# EAGLE schematic Rainbow Badge WIP1 (EAGLE 7.2.0)
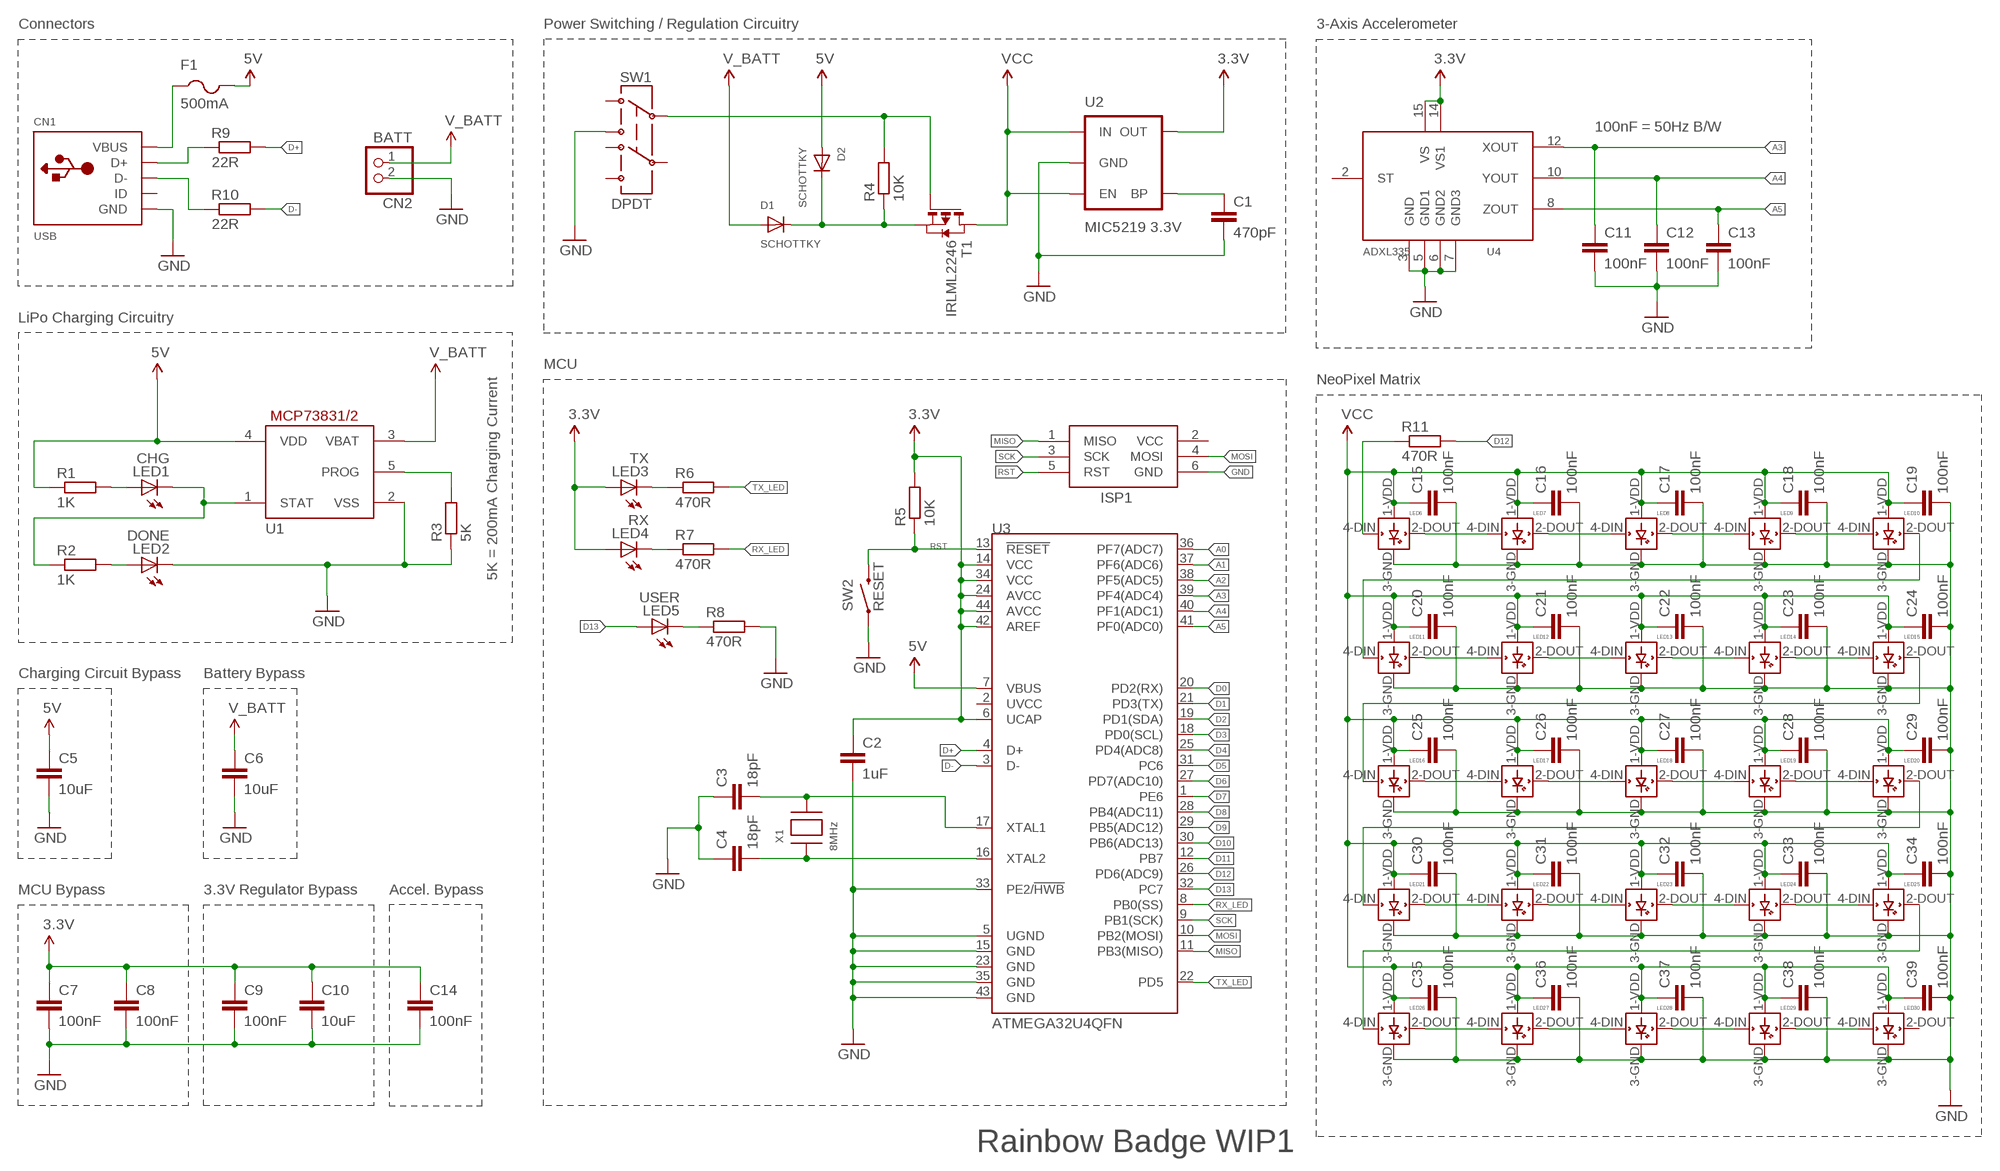
[diagram p0: schematic, sheet 1]

## Parts
C1  470pF  C-EUC0603  [C0603]
C2  1uF  C-EUC0603  [C0603]
C3  18pF  C-EUC0603  [C0603]
C4  18pF  C-EUC0603  [C0603]
C5  10uF  C-EUC1206  [C1206]
C6  10uF  C-EUC1206  [C1206]
C7  100nF  C-EUC0603  [C0603]
C8  100nF  C-EUC0603  [C0603]
C9  100nF  C-EUC0603  [C0603]
C10  10uF  C-EUC1206  [C1206]
C11  100nF  C-EUC0603  [C0603]
C12  100nF  C-EUC0603  [C0603]
C13  100nF  C-EUC0603  [C0603]
C14  100nF  C-EUC0603  [C0603]
C15  100nF  C-EUC0805  [C0805]
C16  100nF  C-EUC0805  [C0805]
C17  100nF  C-EUC0805  [C0805]
C18  100nF  C-EUC0805  [C0805]
C19  100nF  C-EUC0805  [C0805]
C20  100nF  C-EUC0805  [C0805]
C21  100nF  C-EUC0805  [C0805]
C22  100nF  C-EUC0805  [C0805]
C23  100nF  C-EUC0805  [C0805]
C24  100nF  C-EUC0805  [C0805]
C25  100nF  C-EUC0805  [C0805]
C26  100nF  C-EUC0805  [C0805]
C27  100nF  C-EUC0805  [C0805]
C28  100nF  C-EUC0805  [C0805]
C29  100nF  C-EUC0805  [C0805]
C30  100nF  C-EUC0805  [C0805]
C31  100nF  C-EUC0805  [C0805]
C32  100nF  C-EUC0805  [C0805]
C33  100nF  C-EUC0805  [C0805]
C34  100nF  C-EUC0805  [C0805]
C35  100nF  C-EUC0805  [C0805]
C36  100nF  C-EUC0805  [C0805]
C37  100nF  C-EUC0805  [C0805]
C38  100nF  C-EUC0805  [C0805]
C39  100nF  C-EUC0805  [C0805]
CN1  USB  USBMINIB  [USB-MINIB]
CN2  BATT  JST_2PIN-SMT-RA  [JST-PH-2-SMT-RA]
D1  SCHOTTKY  DIODESOD-123  [SOD-123]
D2  SCHOTTKY  DIODESOD-123  [SOD-123]
F1  500mA  PTCFUSE-1206  [R1206]
ISP1  AVRISP  AVRISP-6  [AVRISP]
LED1  CHG  LEDCHIP-LED0603  [CHIP-LED0603]
LED2  DONE  LEDCHIP-LED0603  [CHIP-LED0603]
LED3  TX  LEDCHIP-LED0603  [CHIP-LED0603]
LED4  RX  LEDCHIP-LED0603  [CHIP-LED0603]
LED5  USER  LEDCHIP-LED0603  [CHIP-LED0603]
LED6  WS2812B  [WS2812B]
LED7  WS2812B  [WS2812B]
LED8  WS2812B  [WS2812B]
LED9  WS2812B  [WS2812B]
LED10  WS2812B  [WS2812B]
LED11  WS2812B  [WS2812B]
LED12  WS2812B  [WS2812B]
LED13  WS2812B  [WS2812B]
LED14  WS2812B  [WS2812B]
LED15  WS2812B  [WS2812B]
LED16  WS2812B  [WS2812B]
LED17  WS2812B  [WS2812B]
LED18  WS2812B  [WS2812B]
LED19  WS2812B  [WS2812B]
LED20  WS2812B  [WS2812B]
LED21  WS2812B  [WS2812B]
LED22  WS2812B  [WS2812B]
LED23  WS2812B  [WS2812B]
LED24  WS2812B  [WS2812B]
LED25  WS2812B  [WS2812B]
LED26  WS2812B  [WS2812B]
LED27  WS2812B  [WS2812B]
LED28  WS2812B  [WS2812B]
LED29  WS2812B  [WS2812B]
LED30  WS2812B  [WS2812B]
R1  1K  R-EU_R0603  [R0603]
R2  1K  R-EU_R0603  [R0603]
R3  5K  R-EU_R0603  [R0603]
R4  10K  R-EU_R0603  [R0603]
R5  10K  R-EU_R0603  [R0603]
R6  470R  R-EU_R0603  [R0603]
R7  470R  R-EU_R0603  [R0603]
R8  470R  R-EU_R0603  [R0603]
R9  22R  R-EU_R0603  [R0603]
R10  22R  R-EU_R0603  [R0603]
R11  470R  R-EU_R0603  [R0603]
SW1  DPDT  SWITCH-DPDTAYZ0202  [AYZ0202]
SW2  RESET  SWITCH-MOMENTARY-2SMD  [TACTILE-SWITCH-SMD]
T1  IRLML2246  PMOSSOT23  [SOT-23]
U1  MCP73831/OT  [SOT23-5L]
U2  MIC5219 3.3V  V_REG_MIC52193.3V  [SOT23-5]
U3  ATMEGA32U4QFN  [QFN-44]
U4  ADXL335  ADXL33X  [16LCSP]
X1  8MHz  XTALNX5032  [NX5032]

## Nets
3.3V: C2.1 C7.1 C8.1 C9.1 C10.1 C14.1 LED3.A LED4.A R5.2 U2.5(OUT) U3.6(UCAP) U3.14(VCC) U3.24(AVCC) U3.34(VCC) U3.42(AREF) U3.44(AVCC) U4.14(VS1) U4.15(VS)
5V: C5.1 D2.A F1.2 R1.1 U1.4(VDD) U3.7(VBUS)
A0: U3.36(PF7(ADC7))
A1: U3.37(PF6(ADC6))
A2: U3.38(PF5(ADC5))
A3: C11.1 U3.39(PF4(ADC4)) U4.12(XOUT)
A4: C12.1 U3.40(PF1(ADC1)) U4.10(YOUT)
A5: C13.1 U3.41(PF0(ADC0)) U4.8(ZOUT)
D0: U3.20(PD2(RX))
D1: U3.21(PD3(TX))
D2: U3.19(PD1(SDA))
D3: U3.18(PD0(SCL))
D4: U3.25(PD4(ADC8))
D5: U3.31(PC6)
D6: U3.27(PD7(ADC10))
D7: U3.1(PE6)
D8: U3.28(PB4(ADC11))
D9: U3.29(PB5(ADC12))
D10: U3.30(PB6(ADC13))
D11: U3.12(PB7)
D12: R11.2 U3.26(PD6(ADC9))
D13: LED5.A U3.32(PC7)
D+: R9.2 U3.4(D+)
D-: R10.2 U3.3(D-)
GND: C1.2 C2.2 C3.1 C4.1 C5.2 C6.2 C7.2 C8.2 C9.2 C10.2 C11.2 C12.2 C13.2 C14.2 C15.2 C16.2 C17.2 C18.2 C19.2 C20.2 C21.2 C22.2 C23.2 C24.2 C25.2 C26.2 C27.2 C28.2 C29.2 C30.2 C31.2 C32.2 C33.2 C34.2 C35.2 C36.2 C37.2 C38.2 C39.2 CN1.GND CN2.2 ISP1.6(GND) LED2.C LED6.3-GND(GND) LED7.3-GND(GND) LED8.3-GND(GND) LED9.3-GND(GND) LED10.3-GND(GND) LED11.3-GND(GND) LED12.3-GND(GND) LED13.3-GND(GND) LED14.3-GND(GND) LED15.3-GND(GND) LED16.3-GND(GND) LED17.3-GND(GND) LED18.3-GND(GND) LED19.3-GND(GND) LED20.3-GND(GND) LED21.3-GND(GND) LED22.3-GND(GND) LED23.3-GND(GND) LED24.3-GND(GND) LED25.3-GND(GND) LED26.3-GND(GND) LED27.3-GND(GND) LED28.3-GND(GND) LED29.3-GND(GND) LED30.3-GND(GND) R3.1 R8.2 SW1.3 SW2.1 U1.2(VSS) U2.2(GND) U3.5(UGND) U3.15(GND) U3.23(GND) U3.33(PE2/!HWB) U3.35(GND) U3.43(GND) U4.3(GND) U4.5(GND1) U4.6(GND2) U4.7(GND3)
MISO: ISP1.1(MISO) U3.11(PB3(MISO))
MOSI: ISP1.4(MOSI) U3.10(PB2(MOSI))
N$1: LED1.C R2.1 U1.1(STAT)
N$2: LED2.A R2.2
N$3: LED1.A R1.2
N$4: R3.2 U1.5(PROG)
N$5: CN1.VBUS F1.1
N$6: LED3.C R6.1
N$7: C1.1 U2.4(BP)
N$8: R4.2 SW1.2 T1.3(G)
N$9: D1.C D2.C R4.1 T1.2(S)
N$10: C3.2 U3.17(XTAL1) X1.P$2
N$11: C4.2 U3.16(XTAL2) X1.P$1
N$12: LED4.C R7.1
N$13: LED5.C R8.1
N$14: CN1.D+ R9.1
N$15: CN1.D- R10.1
N$16: LED6.4-DIN(DIN) R11.1
N$66: LED6.2-DOUT(DOUT) LED7.4-DIN(DIN)
N$67: LED7.2-DOUT(DOUT) LED8.4-DIN(DIN)
N$68: LED8.2-DOUT(DOUT) LED9.4-DIN(DIN)
N$69: LED9.2-DOUT(DOUT) LED10.4-DIN(DIN)
N$70: LED11.2-DOUT(DOUT) LED12.4-DIN(DIN)
N$71: LED12.2-DOUT(DOUT) LED13.4-DIN(DIN)
N$72: LED13.2-DOUT(DOUT) LED14.4-DIN(DIN)
N$73: LED14.2-DOUT(DOUT) LED15.4-DIN(DIN)
N$74: LED16.2-DOUT(DOUT) LED17.4-DIN(DIN)
N$75: LED17.2-DOUT(DOUT) LED18.4-DIN(DIN)
N$76: LED18.2-DOUT(DOUT) LED19.4-DIN(DIN)
N$77: LED19.2-DOUT(DOUT) LED20.4-DIN(DIN)
N$78: LED21.2-DOUT(DOUT) LED22.4-DIN(DIN)
N$79: LED22.2-DOUT(DOUT) LED23.4-DIN(DIN)
N$80: LED23.2-DOUT(DOUT) LED24.4-DIN(DIN)
N$81: LED24.2-DOUT(DOUT) LED25.4-DIN(DIN)
N$82: LED26.2-DOUT(DOUT) LED27.4-DIN(DIN)
N$83: LED27.2-DOUT(DOUT) LED28.4-DIN(DIN)
N$84: LED28.2-DOUT(DOUT) LED29.4-DIN(DIN)
N$85: LED29.2-DOUT(DOUT) LED30.4-DIN(DIN)
N$86: LED10.2-DOUT(DOUT) LED11.4-DIN(DIN)
N$87: LED15.2-DOUT(DOUT) LED16.4-DIN(DIN)
N$88: LED20.2-DOUT(DOUT) LED21.4-DIN(DIN)
N$89: LED25.2-DOUT(DOUT) LED26.4-DIN(DIN)
RST: ISP1.5(RST) R5.1 SW2.3 U3.13(!RESET)
RX_LED: R7.2 U3.8(PB0(SS))
SCK: ISP1.3(SCK) U3.9(PB1(SCK))
TX_LED: R6.2 U3.22(PD5)
V_BATT: C6.1 CN2.1 D1.A U1.3(VBAT)
VCC: C15.1 C16.1 C17.1 C18.1 C19.1 C20.1 C21.1 C22.1 C23.1 C24.1 C25.1 C26.1 C27.1 C28.1 C29.1 C30.1 C31.1 C32.1 C33.1 C34.1 C35.1 C36.1 C37.1 C38.1 C39.1 LED6.1-VDD(VDD) LED7.1-VDD(VDD) LED8.1-VDD(VDD) LED9.1-VDD(VDD) LED10.1-VDD(VDD) LED11.1-VDD(VDD) LED12.1-VDD(VDD) LED13.1-VDD(VDD) LED14.1-VDD(VDD) LED15.1-VDD(VDD) LED16.1-VDD(VDD) LED17.1-VDD(VDD) LED18.1-VDD(VDD) LED19.1-VDD(VDD) LED20.1-VDD(VDD) LED21.1-VDD(VDD) LED22.1-VDD(VDD) LED23.1-VDD(VDD) LED24.1-VDD(VDD) LED25.1-VDD(VDD) LED26.1-VDD(VDD) LED27.1-VDD(VDD) LED28.1-VDD(VDD) LED29.1-VDD(VDD) LED30.1-VDD(VDD) T1.1(D) U2.1(IN) U2.3(EN)
Unconnected: CN1.ID LED30.2-DOUT(DOUT) SW1.1 SW1.4 SW1.5 SW1.6 U3.2(UVCC) U4.2(ST)

## Notes on the sheet
- Connectors | Power Switching / Regulation Circuitry | 3-Axis Accelerometer
- 100nF = 50Hz B/W
- LiPo Charging Circuitry
- MCU
- NeoPixel Matrix
- 5K = 200mA Charging Current
- Charging Circuit Bypass | Battery Bypass
- MCU Bypass | 3.3V Regulator Bypass | Accel. Bypass
- Rainbow Badge WIP1

## Power pins joined to a net without a drawn wire
VCC: ISP1.2(VCC)

## Library data of the parts
C1-C39 = rcl:C-EU: CAPACITOR, European symbol
CN1 = adafruit:USB: USB Connectors USBMINIB - Surface Mount Female Mini-B USB Connector 4UConnector: 06564 By microbuilder.eu Thru-hole RA Female Mini-B USB Connector 4UConnector: 18732 By ladyada.net
CN2 = adafruit:JST_2PIN: JST 2-Pin Connectors of various flavors SMT-RA (S2B-PH-SM4) 4UConnector #17311 SMT (B2B-PH-SM4) THM-RA (S2B-PH) THM (B2B-PH)
D1 D2 = adafruit:DIODE: Diode SMADIODE - SMA Surface Mount Package 20V 1A Schottky Diode Digikey: 641-1014-6-ND DO-1N4148 - Through Hole Small Current Diode SOD-123 20V 1 A (.5mV Vf) Schottky Diode - Digikey: MBRX120TPMSCT-ND SOD-323 10V 570mA (.38mV Vf, 3ns) Schottky Diode - Digikey: ZLLS410CT-ND SOD-523 30V 30mA Schottky Diode (RB751S-40TE61) - Digikey: RB751S-40TE61CT-ND SOT23-R/W - SOT23 Package (R = Solder Paste/Reflow Ovens, W = Hand-Soldering) BAT54Film 40V 300mA - Digikey: 497-7162-1-ND
F1 = adafruit:PTCFUSE: PTC fuses, resettable thermistors
ISP1 = adafruit:AVRISP: AVR ISP HEADER Standard 6 pin header for AVR programming
LED1-LED5 = led:LED: LED OSRAM: - CHIPLED LG R971, LG N971, LY N971, LG Q971, LY Q971, LO R971, LY R971 LH N974, LH R974 LS Q976, LO Q976, LY Q976 LO Q996 - Hyper CHIPLED LW Q18S LB Q993, LB Q99A, LB R99A - SideLED LS A670, LO A670, LY A670, LG A670, LP A670 LB A673, LV A673, LT A673, LW A673 LH A674 LY A675 LS A676, LA A676, LO A676, LY A676, LW A676 LS A679, LY A679, LG A679 - Hyper Micro SIDELED® LS Y876, LA Y876, LO Y876, LY Y876 LT Y87S - SmartLED LW L88C, LW L88S LB L89C, LB L89S, LG L890 LS L89K, LO L89K, LY L89K LS L896, LA L896, LO L896, LY L896 - TOPLED LS T670, LO T670, LY T670, LG T670, LP T670 LSG T670, LSP T670, LSY T670, LOP T670, LYG T670 LG T671, LOG T671, LSG T671 LB T673, LV T673, LT T673, LW T673 LH T674 LS T676, LA T676, LO T676, LY T676, LB T676, LH T676, LSB T676, LW T676 LB T67C, LV T67C, LT T67C, LS T67K, LO T67K, LY T67K, LW E67C LS E67B, LA E67B, LO E67B, LY E67B, LB E67C, LV E67C, LT E67C LW T67C LS T679, LY T679, LG T679 LS T770, LO T770, LY T770, LG T770, LP T770 LB T773, LV T773, LT T773, LW T773 LH T774 LS E675, LA E675, LY E675, LS T675 LS T776, LA T776, LO T776, LY T776, LB T776 LHGB T686 LT T68C, LB T68C - Hyper Mini TOPLED® LB M676 - Mini TOPLED Santana® LG M470 LS M47K, LO M47K, LY M47K Source: http://www.osram.convergy.de LUXEON: - LUMILED® LXK2-PW12-R00, LXK2-PW12-S00, LXK2-PW14-U00, LXK2-PW14-V00 LXK2-PM12-R00, LXK2-PM12-S00, LXK2-PM14-U00 LXK2-PE12-Q00, LXK2-PE12-R00, LXK2-PE12-S00, LXK2-PE14-T00, LXK2-PE14-U00 LXK2-PB12-K00, LXK2-PB12-L00, LXK2-PB12-M00, LXK2-PB14-N00, LXK2-PB14-P00, LXK2-PB14-Q00 LXK2-PR12-L00, LXK2-PR12-M00, LXK2-PR14-Q00, LXK2-PR14-R00 LXK2-PD12-Q00, LXK2-PD12-R00, LXK2-PD12-S00 LXK2-PH12-R00, LXK2-PH12-S00 LXK2-PL12-P00, LXK2-PL12-Q00, LXK2-PL12-R00 Source: www.luxeon.com KINGBRIGHT: KA-3528ASYC Source: www.kingbright.com
LED6-LED30 = adafruit:WS2812B
R1-R11 = rcl:R-EU_: RESISTOR, European symbol
SW1 = SparkFun-Electromechanical:SWITCH-DPDT: DPDT Version of the COM-00597; PROD_ID: SWCH-08179
SW2 = SparkFun-Electromechanical:SWITCH-MOMENTARY-2: Various NO switches- pushbuttons, reed, etc; PROD_ID: SWCH-08247
T1 = zetex:PMOSSOT23: MOS FET; OC_FARNELL: unknown; OC_NEWARK: unknown
U1 = adafruit:MCP73831: MCP73831/2 Miniature Single-Cell, Fully Integrated Li-Ion, Li-Polymer Charge Management Controllers. Nice and small simple lipoly charge controller, with adjustable current and status output (LED) http://www.ladyada.net/library/pcb/eaglelibrary.html
U2 = SparkFun-PowerIC:V_REG_MIC5219: V_REG MIC5219 Standard 3.3V and 5V 500mA LDO voltage regulator in SOT-23 layout. Micrel part MIC5219. BP (by-pass) pin is used to lower output noise with 470pF cap, may be left open.; PROD_ID: VREG-09872
U3 = SparkFun-DigitalIC:ATMEGA32U4: Atmel 44-pin 8-bit Microcontroller with 32KBytes of ISP Flash and USB Controller
U4 = adafruit:ADXL33X
X1 = adafruit:XTAL: Low cost SMT crystals, no capacitors included http://www.ladyada.net/library/eagle